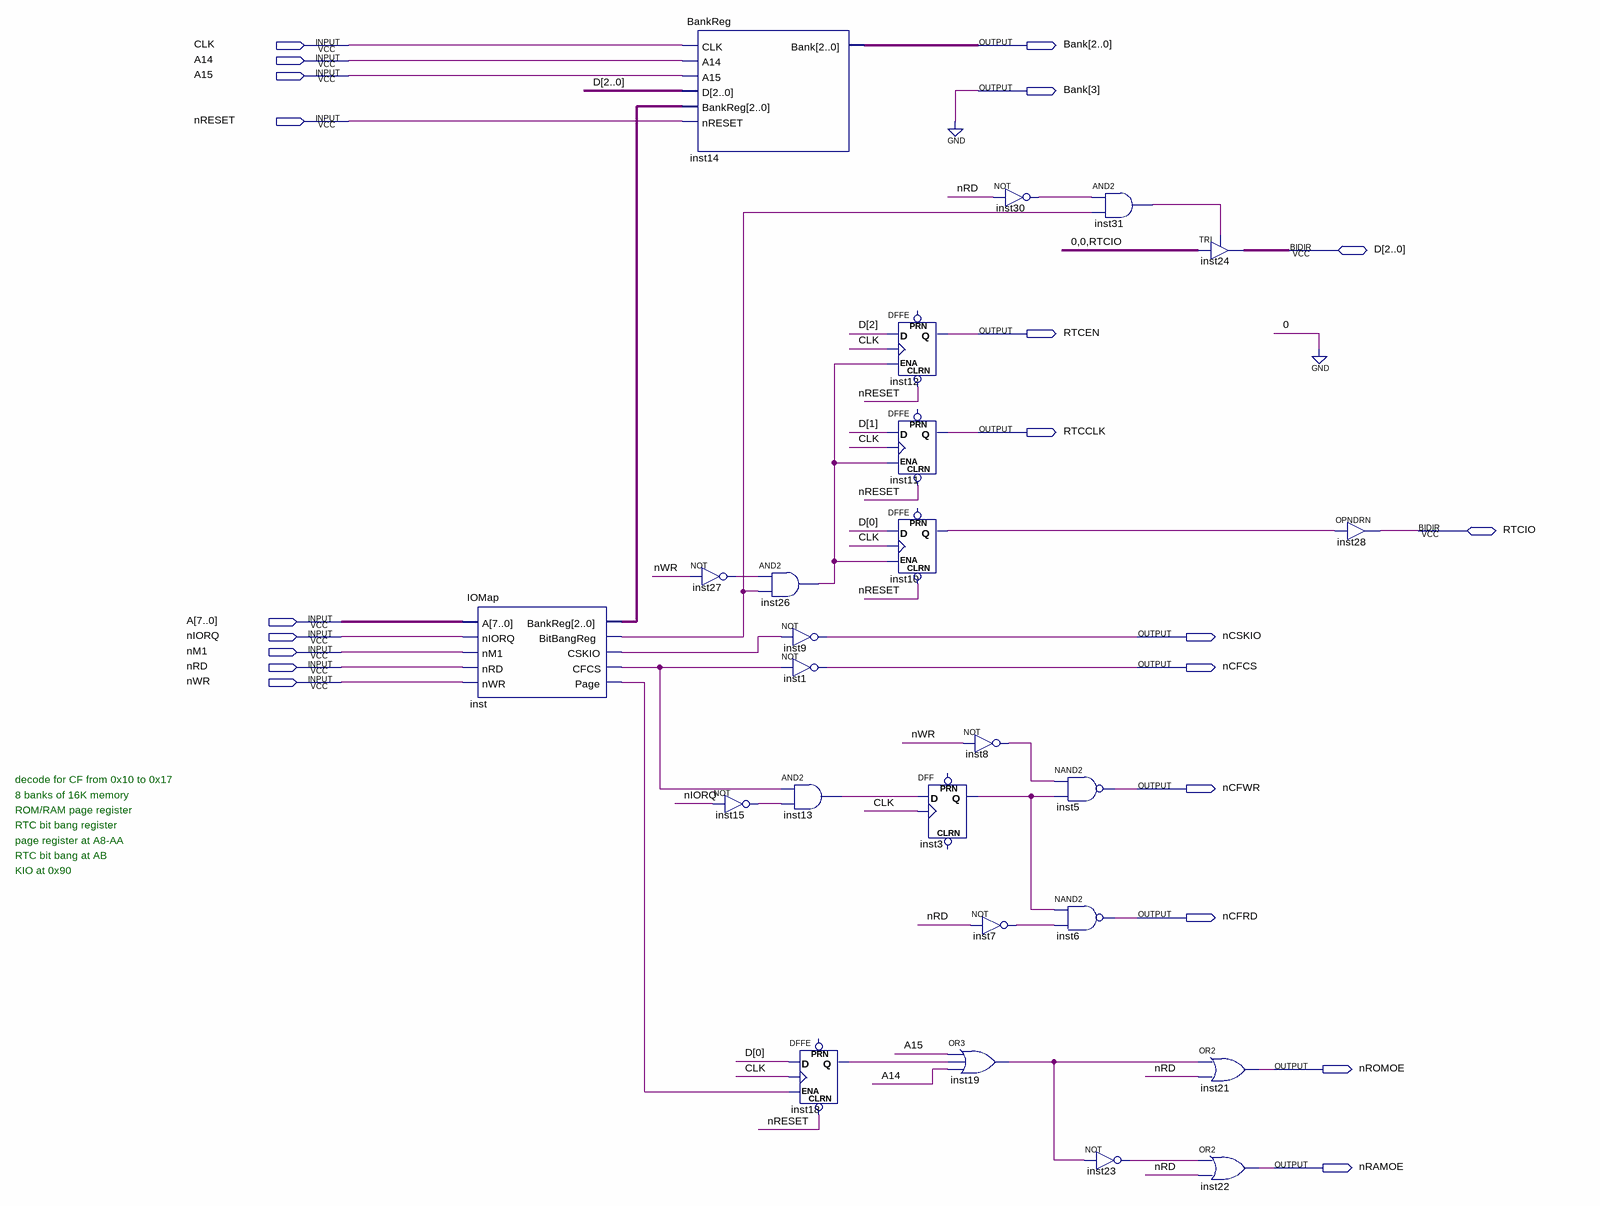
[diagram p0: schematic sheet]
// Quartus schematic top.bdf as structural Verilog: 25 symbols, 21 pins
module top (
  input  CLK,
  input  A14,
  input  A15,
  input  nRESET,
  input  [7:0] A,
  input  nIORQ,
  input  nM1,
  input  nRD,
  input  nWR,
  inout  [2:0] D,
  inout  RTCIO,
  output [3:0] Bank,
  output RTCEN,
  output RTCCLK,
  output nCSKIO,
  output nCFCS,
  output nCFWR,
  output nCFRD,
  output nROMOE,
  output nRAMOE
);

  wire inst3_q, inst7_out, inst8_out, inst10_q, inst13_out, inst15_out, inst18_q, inst19_out, inst23_out,
       inst26_out, inst27_out, inst30_out, inst31_out, inst_bitbangreg, inst_cfcs, inst_cskio, inst_page;
  wire [2:0] inst_bankreg;

  IOMap inst (
    .A(A), .nIORQ(nIORQ), .nM1(nM1), .nRD(nRD), .nWR(nWR), .BankReg(inst_bankreg),
    .BitBangReg(inst_bitbangreg), .CSKIO(inst_cskio), .CFCS(inst_cfcs), .Page(inst_page));
  BankReg inst14 (.CLK(CLK), .A14(A14), .A15(A15), .D(D), .BankReg(inst_bankreg), .nRESET(nRESET), .Bank(Bank[2:0]));
  not inst27 (inst27_out, nWR);
  and inst26 (inst26_out, inst27_out, inst_bitbangreg);
  not inst15 (inst15_out, nIORQ);
  not inst9 (nCSKIO, inst_cskio);
  not inst1 (nCFCS, inst_cfcs);
  and inst13 (inst13_out, inst_cfcs, inst15_out);
  DFFE inst18 (.CLRN(nRESET), .D(D[0]), .CLK(CLK), .ENA(inst_page), .Q(inst18_q));  // open: PRN
  DFFE inst12 (.CLRN(nRESET), .D(D[2]), .CLK(CLK), .ENA(inst26_out), .Q(RTCEN));  // open: PRN
  DFFE inst11 (.CLRN(nRESET), .D(D[1]), .CLK(CLK), .ENA(inst26_out), .Q(RTCCLK));  // open: PRN
  DFFE inst10 (.CLRN(nRESET), .D(D[0]), .CLK(CLK), .ENA(inst26_out), .Q(inst10_q));  // open: PRN
  DFF inst3 (.CLK(CLK), .D(inst13_out), .Q(inst3_q));  // open: CLRN, PRN
  or inst19 (inst19_out, A15, inst18_q, A14);
  not inst30 (inst30_out, nRD);
  not inst8 (inst8_out, nWR);
  not inst7 (inst7_out, nRD);
  nand inst5 (nCFWR, inst8_out, inst3_q);
  nand inst6 (nCFRD, inst3_q, inst7_out);
  and inst31 (inst31_out, inst30_out, inst_bitbangreg);
  not inst23 (inst23_out, inst19_out);
  TRI inst24[2:0] (.IN({2'b00, RTCIO}), .OE(inst31_out), .OUT(D));
  or inst21 (nROMOE, inst19_out, nRD);
  or inst22 (nRAMOE, inst23_out, nRD);
  OPNDRN inst28 (.IN(inst10_q), .OUT(RTCIO));

  assign Bank[3] = 1'b0;

  // Notes on the sheet:
  //   decode for CF from 0x10 to 0x17
  //   8 banks of 16K memory
  //   ROM/RAM page register
  //   RTC bit bang register
  //   page register at A8-AA
  //   RTC bit bang at AB
  //   KIO at 0x90
endmodule
